# EAGLE design threshold_control_device (EAGLE 5.11)
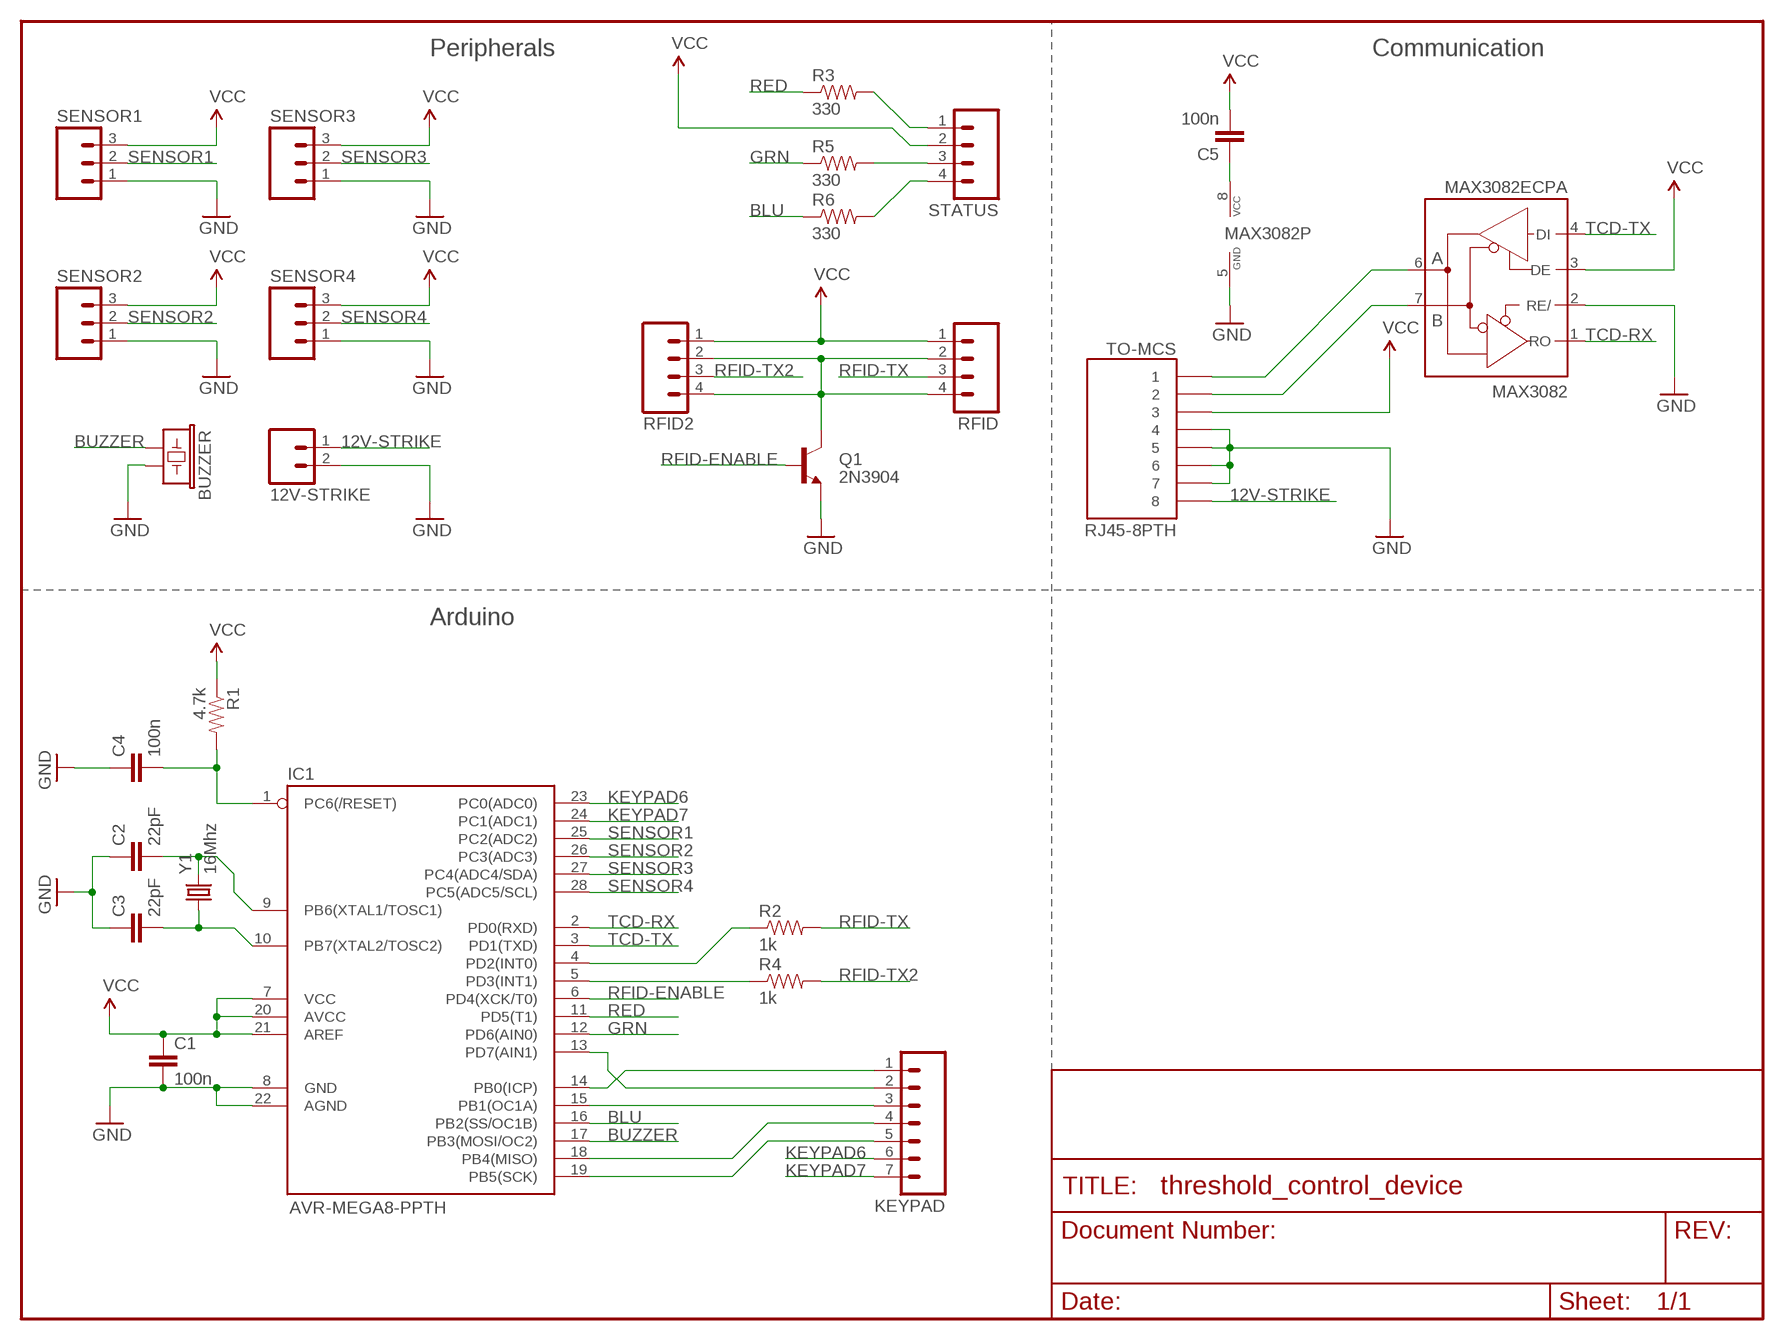
[diagram p0: schematic, sheet 1]

## Parts
12V-STRIKE  M023.5MM  [SCREWTERMINAL-3.5MM-2]
BUZZER  BUZZERPTH  [BUZZER-12MM]
C1  100n  CAPPTH  [CAP-PTH-SMALL]
C2  22pF  CAPPTH  [CAP-PTH-SMALL]
C3  22pF  CAPPTH  [CAP-PTH-SMALL]
C4  100n  CAPPTH  [CAP-PTH-SMALL]
C5  100n  CAPPTH  [CAP-PTH-SMALL]
IC1  AVR-MEGA8-PPTH  [DIL28-3]
KEYPAD  M07  [1X07]
MAX3082  MAX3082ECPA  MAX481CPA  [DIL08]
Q1  2N3904  TRANSISTOR_NPNTO-92-AMMO  [TO-92-AMMO]
R1  4.7k  RESISTORPTH-1/4W  [AXIAL-0.4]
R2  1k  RESISTORPTH-1/4W  [AXIAL-0.4]
R3  330  RESISTORPTH-1/4W  [AXIAL-0.4]
R4  1k  RESISTORPTH-1/4W  [AXIAL-0.4]
R5  330  RESISTORPTH-1/4W  [AXIAL-0.4]
R6  330  RESISTORPTH-1/4W  [AXIAL-0.4]
RFID  M04PTH  [1X04]
RFID2  M04PTH  [1X04]
SENSOR1  M03PTH  [1X03]
SENSOR2  M03PTH  [1X03]
SENSOR3  M03PTH  [1X03]
SENSOR4  M03PTH  [1X03]
STATUS  M04PTH  [1X04]
TO-MCS  RJ45-8PTH  [RJ45-8]
Y1  16Mhz  CRYSTALHC49US  [HC49US]

## Nets
12V-STRIKE: 12V-STRIKE.1 TO-MCS.8
BLU: IC1.16(PB2(SS/OC1B)) R6.P$1
BUZZER: BUZZER.+ IC1.17(PB3(MOSI/OC2))
GND: 12V-STRIKE.2 BUZZER.- C1.2 C2.1 C3.1 C4.1 IC1.8(GND) IC1.22(AGND) MAX3082.2(RE/) MAX3082.5(GND) Q1.1(E) SENSOR1.1 SENSOR2.1 SENSOR3.1 SENSOR4.1 TO-MCS.4 TO-MCS.5 TO-MCS.6 TO-MCS.7
GRN: IC1.12(PD6(AIN0)) R5.P$1
KEYPAD6: IC1.23(PC0(ADC0)) KEYPAD.6
KEYPAD7: IC1.24(PC1(ADC1)) KEYPAD.7
N$1: C3.2 IC1.10(PB7(XTAL2/TOSC2)) Y1.1
N$2: C2.2 IC1.9(PB6(XTAL1/TOSC1)) Y1.2
N$3: IC1.19(PB5(SCK)) KEYPAD.5
N$4: R3.P$2 STATUS.1
N$5: IC1.14(PB0(ICP)) KEYPAD.1
N$6: MAX3082.6(A) TO-MCS.1
N$7: IC1.18(PB4(MISO)) KEYPAD.4
N$8: IC1.13(PD7(AIN1)) KEYPAD.2
N$9: MAX3082.7(B) TO-MCS.2
N$10: IC1.4(PD2(INT0)) R2.P$1
N$11: Q1.3(C) RFID2.2 RFID2.4 RFID.2 RFID.4
N$12: IC1.15(PB1(OC1A)) KEYPAD.3
N$13: R5.P$2 STATUS.3
N$14: C5.1 MAX3082.8(VCC)
N$15: IC1.5(PD3(INT1)) R4.P$1
N$16: R6.P$2 STATUS.4
RED: IC1.11(PD5(T1)) R3.P$1
RESET: C4.2 IC1.1(PC6(/RESET)) R1.P$2
RFID-ENABLE: IC1.6(PD4(XCK/T0)) Q1.2(B)
RFID-TX: R2.P$2 RFID.3
RFID-TX2: R4.P$2 RFID2.3
SENSOR1: IC1.25(PC2(ADC2)) SENSOR1.2
SENSOR2: IC1.26(PC3(ADC3)) SENSOR2.2
SENSOR3: IC1.27(PC4(ADC4/SDA)) SENSOR3.2
SENSOR4: IC1.28(PC5(ADC5/SCL)) SENSOR4.2
TCD-RX: IC1.2(PD0(RXD)) MAX3082.1(RO)
TCD-TX: IC1.3(PD1(TXD)) MAX3082.4(DI)
VCC: C1.1 C5.2 IC1.7(VCC) IC1.20(AVCC) IC1.21(AREF) MAX3082.3(DE) R1.P$1 RFID2.1 RFID.1 SENSOR1.3 SENSOR2.3 SENSOR3.3 SENSOR4.3 STATUS.2 TO-MCS.3

## Notes on the sheet
- Peripherals | Communication
- Arduino

## Library data of the parts
12V-STRIKE = SparkFun:M02: Header 2 Standard 2-pin 0.1" header. Use with straight break away headers (SKU : PRT-00116), right angle break away headers (PRT-00553), swiss pins (PRT-00743), machine pins (PRT-00117), and female headers (PRT-00115). Molex polarized connector foot print use with SKU : PRT-08233 with associated crimp pins and housings.
BUZZER = SparkFun:BUZZER: Buzzer 12mm Spark Fun Electronics SKU : Comp-Buzzer
C1-C5 = SparkFun:CAP: Capacitor Standard 0603 ceramic capacitor, and 0.1" leaded capacitor.
IC1 = SparkFun:AVR-MEGA8-P: MICROCONTROLLER 8 Kbytes FLASH 1 kbytes SRAM 512 bytes EEPROM USART 4-channel 10 bit ADC 2-channel 8 bit ADC
KEYPAD = SparkFun:M07: Header 7 Standard 7-pin 0.1" header. Use with straight break away headers (SKU : PRT-00116), right angle break away headers (PRT-00553), swiss pins (PRT-00743), machine pins (PRT-00117), and female headers (PRT-00115). NOTES ON THE VARIANTS LOCK and LOCK_LONGPADS... This footprint was designed to help hold the alignment of a through-hole component (i.e. 7-pin header) while soldering it into place. You may notice that each hole has been shifted either up or down by 0.005 of an inch from it's more standard position (which is usually a perfectly straight line). This slight alteration caused the pins (the squares in the middle) to touch the edges of the holes. Because they are alternating, it causes a "brace" to hold the header in place. 0.005 has proven to be the perfect amount of "off-center" position when using our standard breakaway headers. Although looks a little odd when you look at the bare footprint, once you have a header in there, the alteration is very hard to notice. Also, if you push a header all the way into place, it is covered up entirely on the bottom side. This idea of altering the position of holes to aid alignment will be further integrated into the Sparkfun Library for other footprints. It can help hold any component with 3 or more connection pins.
MAX3082 = maxim:MAX481CPA: RS485 TRANSEIVER; MPN: MAX481CPA+; OC_FARNELL: unknown; OC_NEWARK: 99K3445
Q1 = SparkFun:TRANSISTOR_NPN: Transistor NPN BJT configuration in SOT23 package. MMBT2222 is the common NPN we use. Double check BCE configuration again layout.
R1-R6 = SparkFun:RESISTOR: Resistor Basic schematic elements and footprints for 0603, 1206, and PTH resistors.
RFID RFID2 STATUS = SparkFun:M04: Header 4 Standard 4-pin 0.1" header. Use with straight break away headers (SKU : PRT-00116), right angle break away headers (PRT-00553), swiss pins (PRT-00743), machine pins (PRT-00117), and female headers (PRT-00115). Molex polarized connector foot print use with SKU : PRT-08231 with associated crimp pins and housings. 1MM SMD Version SKU: PRT-10208
SENSOR1-SENSOR4 = SparkFun:M03: Header 3 Standard 3-pin 0.1" header. Use with straight break away headers (SKU : PRT-00116), right angle break away headers (PRT-00553), swiss pins (PRT-00743), machine pins (PRT-00117), and female headers (PRT-00115). Molex polarized connector foot print use with SKU : PRT-08232 with associated crimp pins and housings.
TO-MCS = SparkFun:RJ45-8: RJ45 Jack Simple RJ45, 8-pin connection - connector for common Cat5, Cat5e, and Cat6 Ethernet cables. Footprint not yet proven in production. Connector sku is PRT-00643; Breakout PCB sku is BOB-00716.
Y1 = SparkFun:CRYSTAL: Crystals Various standard crystals. Proven footprints. Spark Fun Electronics SKU : COM-00534

## Board
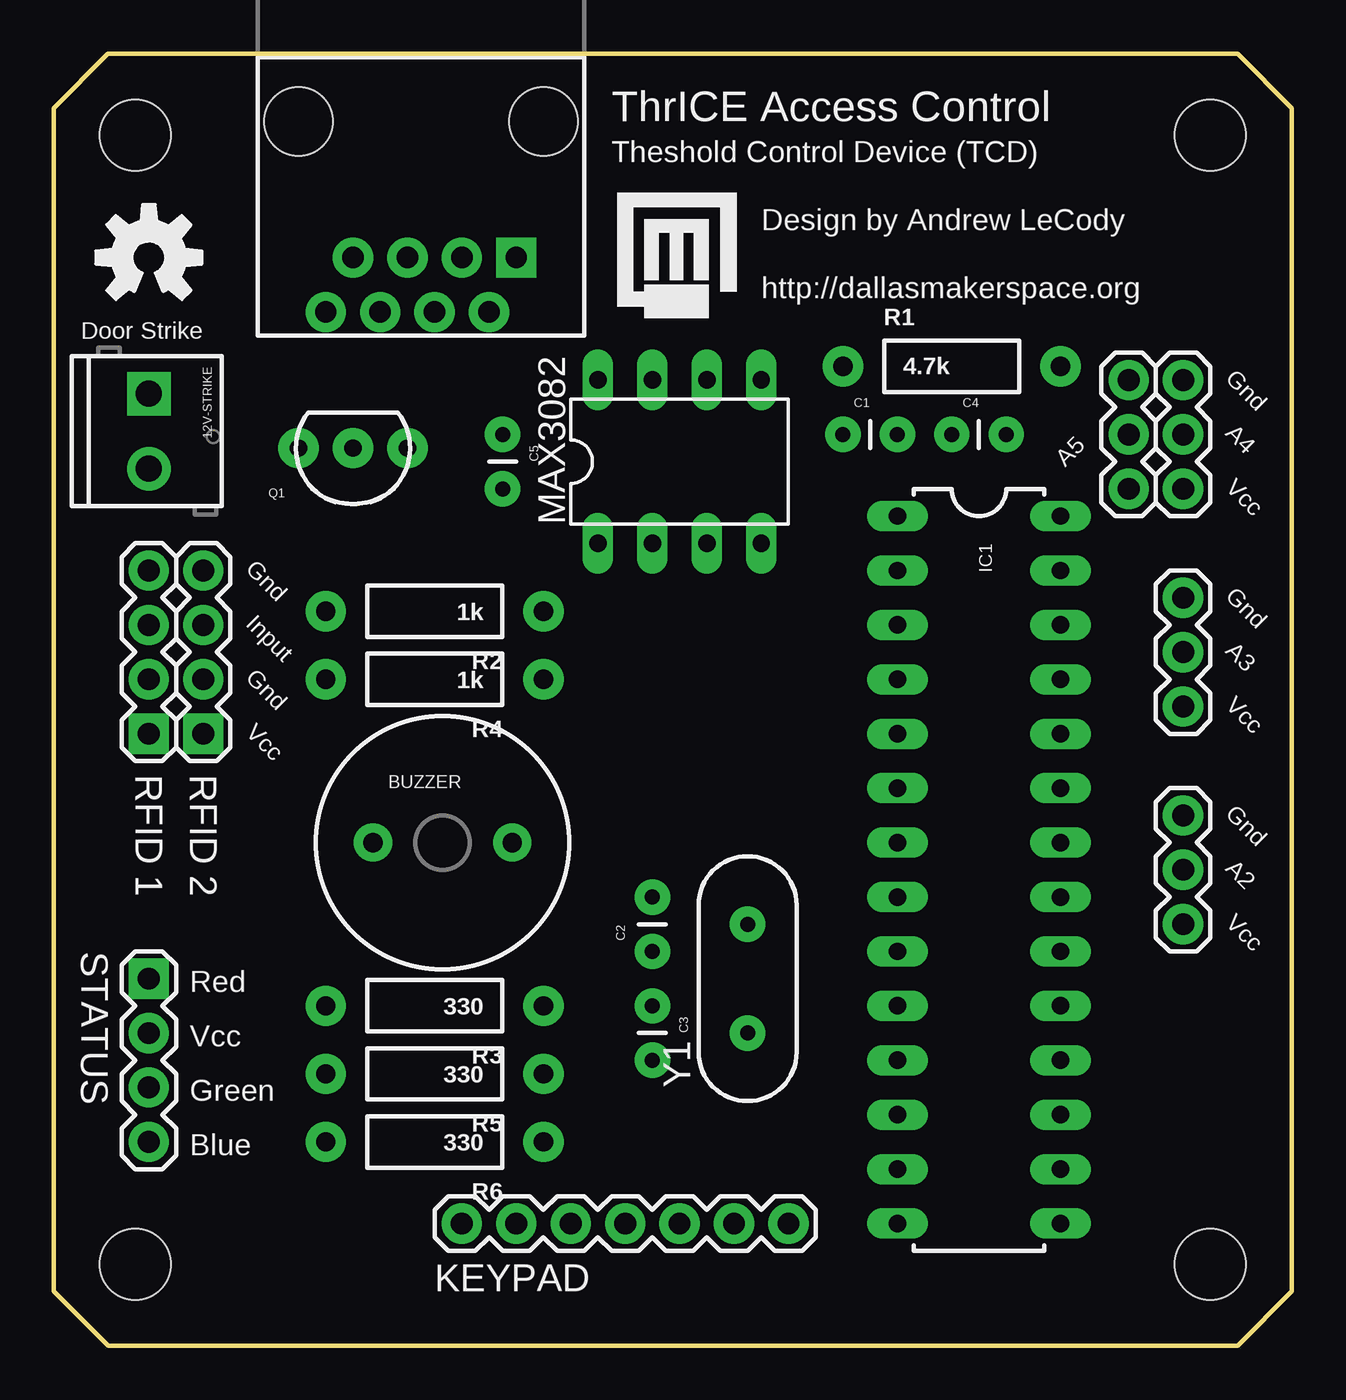
[diagram p1: board, top side]
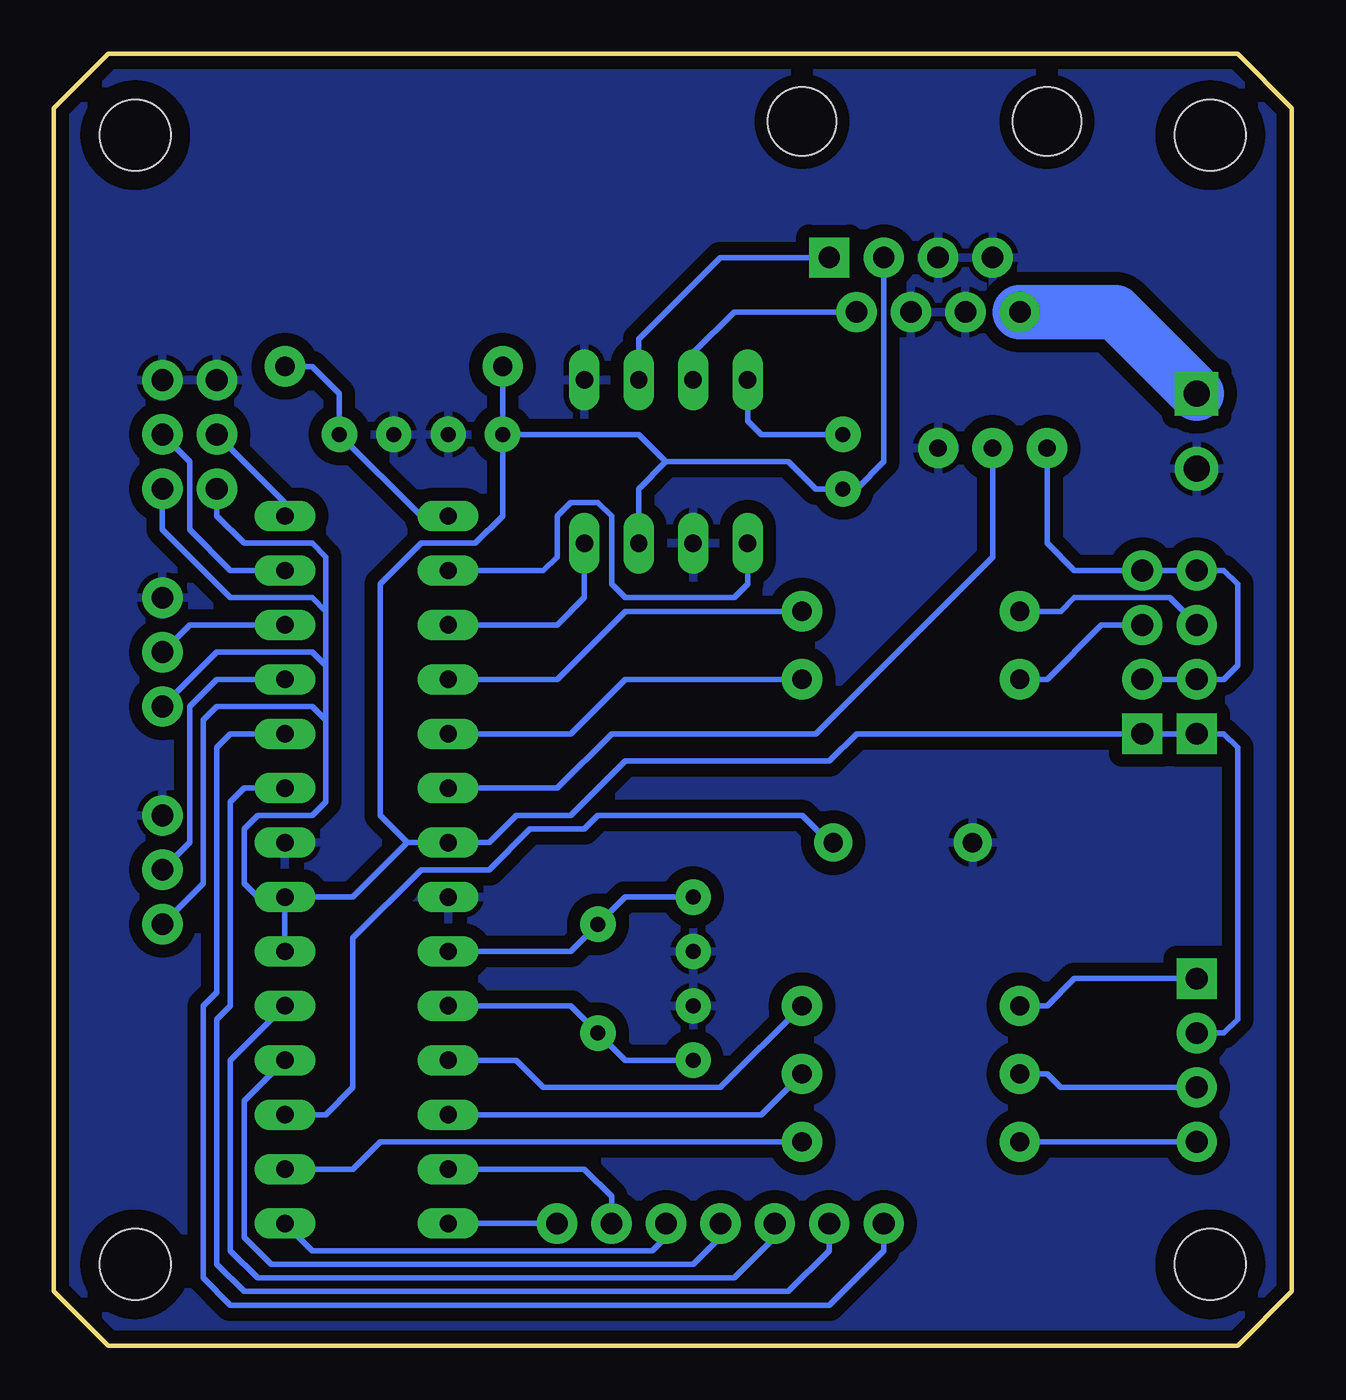
[diagram p2: board, bottom side, seen from below]

Size 57.78 x 60.33 mm. Coordinates in mm from the lower left corner, seen from the top.
Outline: 2.54,0 55.24,0 57.78,2.54 57.78,57.78 55.24,60.33 2.54,60.31 2.53,60.31 0,57.78 0,2.54 2.54,0
Copper layers (1*16): Top 0.035mm / dielectric 1.5mm / Bottom 0.035mm
Design rules "SparkFun": minimum track width 8mil, minimum drill 20mil, track to track 8mil, track to pad 8mil, pad to pad 8mil, via to via 8mil, smd to smd 8mil, copper to edge 10mil, drill to drill 8mil, minimum pad ring 12mil, minimum via ring 10mil, stop-mask expansion 4mil, vias tented up to drill 25mil, thermal gap 10mil

### Footprints (pad centres in the part's own frame; a part is rotated, then mirrored left to right if it is on the bottom)
SCREWTERMINAL-3.5MM-2 = drill 1.2 pad 2.032 square: 1 0,0 | drill 1.2 pad 2.032 round: 2 3.5,0
BUZZER-12MM = drill 0.9 pad 1.778 round: + 3.25,0; - -3.25,0
CAP-PTH-SMALL = drill 0.7 pad 1.651 round: 1 0,0; 2 2.54,0
DIL28-3 = drill 0.813 long: 1 -16.51,-3.81; 2 -13.97,-3.81; 3 -11.43,-3.81; 4 -8.89,-3.81; 5 -6.35,-3.81; 6 -3.81,-3.81; 7 -1.27,-3.81; 8 1.27,-3.81; 9 3.81,-3.81; 10 6.35,-3.81; 11 8.89,-3.81; 12 11.43,-3.81; 13 13.97,-3.81; 14 16.51,-3.81; 15 16.51,3.81; 16 13.97,3.81; 17 11.43,3.81; 18 8.89,3.81; 19 6.35,3.81; 20 3.81,3.81; 21 1.27,3.81; 22 -1.27,3.81; 23 -3.81,3.81; 24 -6.35,3.81; 25 -8.89,3.81; 26 -11.43,3.81; 27 -13.97,3.81; 28 -16.51,3.81
1X07 = drill 1.016 pad 1.88 round: 1 0,0; 2 2.54,0; 3 5.08,0; 4 7.62,0; 5 10.16,0; 6 12.7,0; 7 15.24,0
DIL08 = drill 0.813 long: 1 -3.81,-3.81; 2 -1.27,-3.81; 3 1.27,-3.81; 4 3.81,-3.81; 5 3.81,3.81; 6 1.27,3.81; 7 -1.27,3.81; 8 -3.81,3.81
TO-92-AMMO = drill 0.813 pad 1.88 round: 1 -2.54,0; 2 0,0; 3 2.54,0
AXIAL-0.4 = drill 0.9 pad 1.88 round: P$1 -5.08,0; P$2 5.08,0
1X04 = drill 1.016 pad 1.88 square: 1 0,0 | drill 1.016 pad 1.88 round: 2 2.54,0; 3 5.08,0; 4 7.62,0
1X03 = drill 1.016 pad 1.88 round: 1 0,0; 2 2.54,0; 3 5.08,0
RJ45-8 = drill 1 pad 1.88 square: 1 -4.445,6.35 | drill 1 pad 1.88 round: 2 -3.175,8.89; 3 -1.905,6.35; 4 -0.635,8.89; 5 0.635,6.35; 6 1.905,8.89; 7 3.175,6.35; 8 4.445,8.89 | hole 3.2: -5.715,0; 5.715,0
STAND-OFF = hole 3.302: 0,0
HC49US = drill 0.7 pad 1.651 round: 1 -2.54,0; 2 2.54,0

### Placement (x,y rotation side)
12V-STRIKE  4.45,44.45 270 top
BUZZER  18.15,23.49 0 top
C1  36.83,42.55 0 top
C2  27.94,18.41 90 top
C3  27.94,15.88 270 top
C4  41.91,42.55 0 top
C5  20.95,42.55 270 top
E$1  [OSHW-LOGO-M]  4.45,50.8 0 top
IC1  43.18,22.23 270 top
KEYPAD  34.29,5.71 180 top
MAX3082  29.21,41.27 0 top
Q1  13.97,41.91 180 top
R1  41.91,45.72 0 top
R2  17.78,34.29 180 top
R3  17.78,15.88 180 top
R4  17.78,31.11 180 top
R5  17.78,12.7 180 top
R6  17.78,9.53 180 top
RFID  4.45,28.57 90 top
RFID2  6.99,28.57 90 top
SENSOR1  52.7,24.77 270 top
SENSOR2  52.7,34.92 270 top
SENSOR3  52.7,45.09 270 top
SENSOR4  50.16,45.09 270 top
STATUS  4.45,17.14 270 top
TO-MCS  17.14,57.15 180 top
U$1  [DMS-LOGO]  26.04,47.62 0 top
U$2  [STAND-OFF]  53.98,3.81 0 top
U$3  [STAND-OFF]  3.81,3.81 0 top
U$5  [STAND-OFF]  53.98,56.52 0 top
U$6  [STAND-OFF]  3.81,56.52 0 top
Y1  32.38,17.14 90 top

### Tracks (layer width: path | path; a pad name or v marks a point on that pad's centre or on a via)
12V-STRIKE
  Bottom 2.54: TO-MCS.8 8.26,48.26 12V-STRIKE.1
BLU
  Bottom 0.254: IC1.16 43.81,8.26 42.55,9.53 R6.P$1
BUZZER
  Bottom 0.254: IC1.17 45.09,10.79 43.81,12.06 43.81,19.05 40.64,22.23 37.47,22.23 35.56,24.13 33.02,24.13 32.38,24.77 22.86,24.77 21.59,23.5 BUZZER.+
GND
  pour Bottom (isolate 0.61): -1.91,-1.91 -1.91,62.23 59.05,62.23 59.05,-1.91
GRN
  Bottom 0.254: IC1.12 24.77,10.79 R5.P$1
KEYPAD6
  Bottom 0.254: KEYPAD.6 21.59,4.45 23.5,2.54 48.9,2.54 50.16,3.81 50.16,15.24 49.53,15.88 49.53,25.4 48.9,26.04 IC1.23
KEYPAD7
  Bottom 0.254: KEYPAD.7 19.05,4.45 21.59,1.91 49.53,1.91 50.8,3.17 50.8,15.88 50.16,16.51 50.16,27.94 49.53,28.57 IC1.24
N$1
  Bottom 0.254: IC1.10 33.66,15.88 Y1.1 31.11,13.34 C3.2
N$2
  Bottom 0.254: IC1.9 33.66,18.41 Y1.2 31.11,20.95 C2.2
N$3
  Bottom 0.254: KEYPAD.5 24.13,5.08 26.04,3.17 48.26,3.17 49.53,4.45 49.53,13.34 IC1.19
N$4
  Bottom 0.254: R3.P$2 11.43,15.88 10.16,17.14 STATUS.1
N$5
  Bottom 0.254: KEYPAD.1 IC1.14
N$6
  Bottom 0.254: TO-MCS.1 26.67,50.8 30.48,46.99 MAX3082.6
N$7
  Bottom 0.254: KEYPAD.4 26.67,5.08 27.94,3.81 47.62,3.81 48.9,5.08 48.9,11.43 IC1.18
N$8
  Bottom 0.254: KEYPAD.2 31.75,6.99 33.02,8.26 IC1.13
N$9
  Bottom 0.254: TO-MCS.2 26.04,48.26 27.94,46.35 MAX3082.7
N$10
  Bottom 0.254: IC1.4 34.29,31.11 31.11,34.29 R2.P$1
N$11
  Bottom 0.254: RFID.2 RFID2.2 3.17,31.11 2.54,31.75 2.54,35.56 3.17,36.2 RFID.4 RFID2.4 10.16,36.2 11.43,37.47 Q1.3
N$12
  Bottom 0.254: KEYPAD.3 29.21,5.08 29.84,4.45 45.72,4.45 IC1.15
N$13
  Bottom 0.254: R5.P$2 11.43,12.7 10.79,12.06 STATUS.3
N$14
  Bottom 0.254: MAX3082.8 25.4,43.18 24.77,42.55 C5.1
N$15
  Bottom 0.254: IC1.5 33.66,28.57 31.11,31.11 R4.P$1
N$16
  Bottom 0.254: STATUS.4 R6.P$2
RED
  Bottom 0.254: IC1.11 36.2,13.34 34.92,12.06 26.67,12.06 R3.P$1
RESET
  Bottom 0.254: IC1.1 40.64,38.73 C4.2 44.45,44.45 45.72,45.72 R1.P$2
RFID-ENABLE
  Bottom 0.254: Q1.2 13.97,36.83 22.23,28.57 31.75,28.57 34.29,26.04 IC1.6
RFID-TX
  Bottom 0.254: RFID.3 5.71,34.92 10.16,34.92 10.79,34.29 R2.P$2
RFID-TX2
  Bottom 0.254: RFID2.3 8.89,33.66 11.43,31.11 R4.P$2
SENSOR1
  Bottom 0.254: SENSOR1.2 51.44,23.5 51.44,29.84 50.16,31.11 IC1.25
SENSOR2
  Bottom 0.254: IC1.26 51.44,33.66 SENSOR2.2
SENSOR3
  Bottom 0.254: IC1.27 49.53,36.2 51.44,38.1 51.44,41.27 SENSOR3.2
SENSOR4
  Bottom 0.254: IC1.28 46.99,39.37 SENSOR4.2
TCD-RX
  Bottom 0.254: MAX3082.1 25.4,35.56 26.04,34.92 31.11,34.92 31.75,35.56 31.75,38.73 32.38,39.37 33.66,39.37 34.29,38.73 34.29,36.83 34.92,36.2 IC1.2
TCD-TX
  Bottom 0.254: MAX3082.4 33.02,34.92 34.29,33.66 IC1.3
VCC
  Bottom 0.254: IC1.21 IC1.20 | 41.27,23.5 42.55,24.77 42.55,35.56 40.64,37.47 38.1,37.47 36.83,38.73 C1.1 | 41.27,23.5 IC1.7 37.47,23.5 36.2,24.77 33.66,24.77 31.11,27.3 21.59,27.3 20.32,28.57 RFID2.1 RFID.1 3.17,28.57 2.54,27.94 2.54,15.24 3.17,14.61 STATUS.2 | 41.27,23.5 43.81,20.95 IC1.21 | C1.1 R1.P$1 | TO-MCS.3 19.05,41.27 20.32,40.01 C5.2 22.23,40.01 23.5,41.27 29.21,41.27 | MAX3082.3 30.48,40.01 29.21,41.27 | C1.1 30.48,42.55 29.21,41.27 | 45.09,29.21 45.09,25.4 45.72,24.77 48.26,24.77 48.9,24.13 48.9,21.59 48.26,20.95 IC1.21 | 45.09,29.21 45.72,29.84 50.16,29.84 50.8,29.21 50.8,21.59 SENSOR1.3 | SENSOR2.3 50.16,32.38 45.72,32.38 45.09,31.75 | 45.09,29.21 45.09,31.75 | SENSOR3.3 52.7,38.1 49.53,34.92 45.72,34.92 45.09,34.29 | 45.09,31.75 45.09,34.29 | SENSOR4.3 50.16,38.73 48.9,37.47 45.72,37.47 45.09,36.83 45.09,34.29

### Text on the board
tPlace: ThrICE Access Control | Theshold Control Device (TCD) | Design by Andrew LeCody | http://dallasmakerspace.org | Door Strike | Gnd | A5 | A4 | Vcc | Gnd | Gnd | Input | A3 | Gnd | Vcc | Vcc | RFID 1 | RFID 2 | Gnd | A2 | Vcc | STATUS | Red | Vcc | Green | Blue | KEYPAD